# Altium schematic sheet DRAM_LPDDR4X_200P_2X32bit.SchDoc (part 2 of 2)
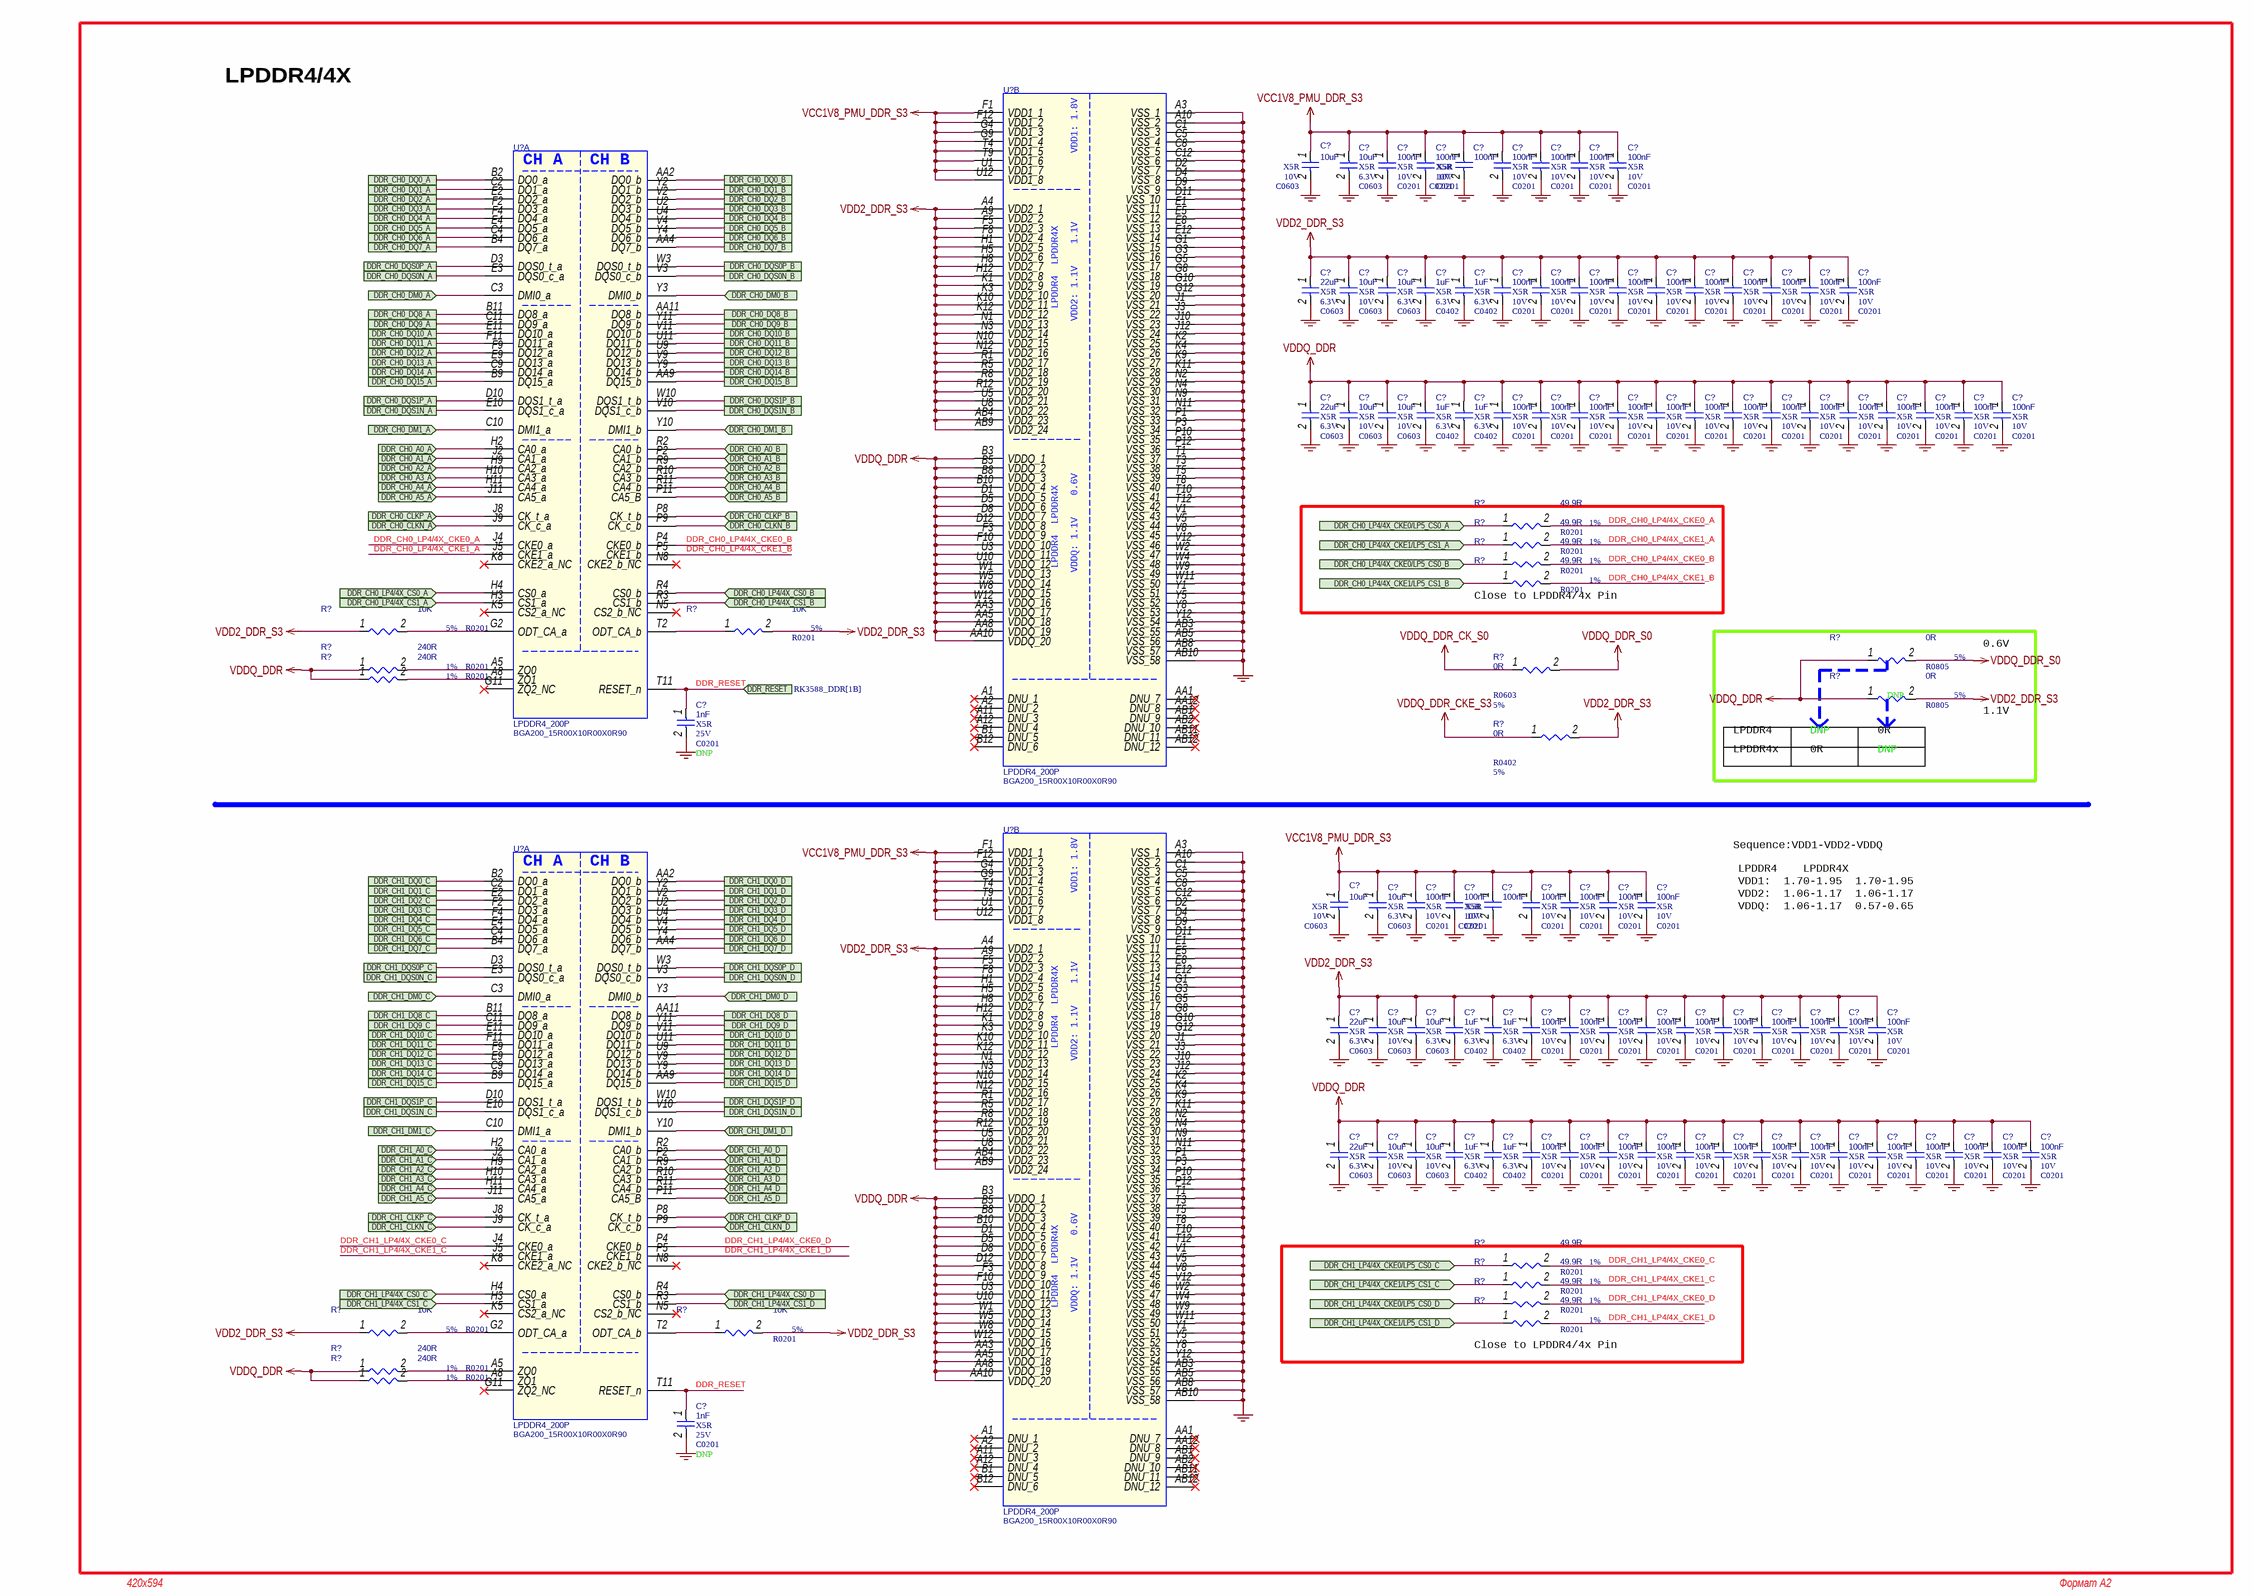
[diagram p1: DRAM_LPDDR4X_200P_2X32bit.SchDoc]

## Library data of the parts
C?#1 = CAP NP_Dup1: cap,10.00uF,+/-10%,10V,X5R,C0603; Part Reference: C3800; Manufacturer PN: C1608X5R1A106K080AC; Manufacturer: TDK; C_Voltage: 6.3V; Tolerance: 10%; Priority: A; Number: 37; PCB Footprint: C0603; Value: 10uF; Created by: JJJ; Part Type: C0603; RK PN: C1608X5R1A106K080AC
C?#2 = CAP NP_Dup1: cap,10.00uF,+/-10%,6.3V,X5R,C0603; Part Reference: C3801; Manufacturer PN: C1608X5R0J106K080AB; Manufacturer: TDK; Tolerance: 10%; Priority: A; PCB Footprint: C0603; Value: 10uF; Created by: JJJ; Part Type: C0603; RK PN: C1608X5R0J106K080AB
C?#3 = CAP NP_Dup1: cap,100.00nF,+/-10%,10V,X5R,C0201; Part Reference: C3802; Manufacturer: TDK; RK PN: C0603X5R1A104K030BC; Priority: A; Tolerance: 10%; PCB Footprint: C0201; Value: 100nF; Part Type: C0201; Manufacturer PN: C0603X5R1A104K030BC; Created by: JJJ
C?#4 = CAP NP_Dup1: cap,100.00nF,+/-10%,10V,X5R,C0201; Part Reference: C3803; Manufacturer PN: C0603X5R1A104K030BC; Manufacturer: TDK; Tolerance: 10%; Priority: A; PCB Footprint: C0201; Value: 100nF; Created by: JJJ; Part Type: C0201; RK PN: C0603X5R1A104K030BC
C?#5 = CAP NP_Dup1: cap,100.00nF,+/-10%,10V,X5R,C0201; Part Reference: C3804; Manufacturer: TDK; Number: 37; RK PN: C0603X5R1A104K030BC; Priority: A; Tolerance: 10%; C_Voltage: 6.3V; PCB Footprint: C0201; Value: 100nF; Part Type: C0201; Manufacturer PN: C0603X5R1A104K030BC; Created by: JJJ
C?#6 = CAP NP_Dup1: cap,100.00nF,+/-10%,10V,X5R,C0201; Part Reference: C3805; Manufacturer: TDK; RK PN: C0603X5R1A104K030BC; Priority: A; Tolerance: 10%; PCB Footprint: C0201; Value: 100nF; Part Type: C0201; Manufacturer PN: C0603X5R1A104K030BC; Created by: JJJ
C?#7 = CAP NP_Dup1: cap,100.00nF,+/-10%,10V,X5R,C0201; Part Reference: C3806; Manufacturer: TDK; RK PN: C0603X5R1A104K030BC; Priority: A; Tolerance: 10%; PCB Footprint: C0201; Value: 100nF; Part Type: C0201; Manufacturer PN: C0603X5R1A104K030BC; Created by: JJJ
C?#8 = CAP NP_Dup1: cap,100.00nF,+/-10%,10V,X5R,C0201; Part Reference: C3807; Manufacturer PN: C0603X5R1A104K030BC; Manufacturer: TDK; Tolerance: 10%; Priority: A; PCB Footprint: C0201; Value: 100nF; Created by: JJJ; Part Type: C0201; RK PN: C0603X5R1A104K030BC
C?#9 = CAP NP_Dup1: cap,100.00nF,+/-10%,10V,X5R,C0201; Part Reference: C3808; Manufacturer PN: C0603X5R1A104K030BC; Manufacturer: TDK; Tolerance: 10%; Priority: A; PCB Footprint: C0201; Value: 100nF; Created by: JJJ; Part Type: C0201; RK PN: C0603X5R1A104K030BC
C?#10 = CAP NP_Dup1: cap,22.00uF,+/-20%,6.3V,X5R,C0603; Part Reference: C3809; Manufacturer PN: C1608X5R0J226M080AC; Manufacturer: TDK; Tolerance: 20%; Priority: A; PCB Footprint: C0603; Value: 22uF; Created by: JJJ; C_Voltage: 6.3V; Part Type: C0603; RK PN: C1608X5R0J226M080AC
C?#11 = CAP NP_Dup1: cap,10.00uF,+/-10%,10V,X5R,C0603; Part Reference: C3810; Manufacturer PN: C1608X5R1A106K080AC; Manufacturer: TDK; Tolerance: 10%; C_Voltage: 6.3V; Priority: A; PCB Footprint: C0603; Value: 10uF; Created by: JJJ; Part Type: C0603; RK PN: C1608X5R1A106K080AC
C?#12 = CAP NP_Dup1: cap,10.00uF,+/-10%,6.3V,X5R,C0603; Part Reference: C3811; Manufacturer PN: C1608X5R0J106K080AB; Manufacturer: TDK; Tolerance: 10%; Priority: A; PCB Footprint: C0603; Value: 10uF; Created by: JJJ; Part Type: C0603; RK PN: C1608X5R0J106K080AB
C?#13 = CAP NP_Dup1: cap,1.00uF,+/-10%,6.3V,X5R,C0402; Part Reference: C3812; Manufacturer PN: C1005X5R0J105K050BB; Manufacturer: TDK; Tolerance: 10%; Priority: A; PCB Footprint: C0402; Value: 1uF; Created by: JJJ; Part Type: C0402; RK PN: C1005X5R0J105K050BB
C?#14 = CAP NP_Dup1: cap,1.00uF,+/-10%,6.3V,X5R,C0402; Part Reference: C3813; Manufacturer PN: C1005X5R0J105K050BB; Manufacturer: TDK; Tolerance: 10%; Priority: A; PCB Footprint: C0402; Value: 1uF; Created by: JJJ; Part Type: C0402; RK PN: C1005X5R0J105K050BB
C?#15 = CAP NP_Dup1: cap,100.00nF,+/-10%,10V,X5R,C0201; Part Reference: C3814; Manufacturer PN: C0603X5R1A104K030BC; Manufacturer: TDK; Tolerance: 10%; Priority: A; PCB Footprint: C0201; Value: 100nF; Created by: JJJ; Part Type: C0201; RK PN: C0603X5R1A104K030BC
C?#16 = CAP NP_Dup1: cap,100.00nF,+/-10%,10V,X5R,C0201; Part Reference: C3815; Manufacturer PN: C0603X5R1A104K030BC; Manufacturer: TDK; Tolerance: 10%; Priority: A; PCB Footprint: C0201; Value: 100nF; Created by: JJJ; Part Type: C0201; RK PN: C0603X5R1A104K030BC
C?#17 = CAP NP_Dup1: cap,100.00nF,+/-10%,10V,X5R,C0201; Part Reference: C3816; Manufacturer: TDK; RK PN: C0603X5R1A104K030BC; Priority: A; Tolerance: 10%; PCB Footprint: C0201; Value: 100nF; Part Type: C0201; Manufacturer PN: C0603X5R1A104K030BC; Created by: JJJ
C?#18 = CAP NP_Dup1: cap,100.00nF,+/-10%,10V,X5R,C0201; Part Reference: C3817; Manufacturer PN: C0603X5R1A104K030BC; Manufacturer: TDK; Tolerance: 10%; Priority: A; PCB Footprint: C0201; Value: 100nF; Created by: JJJ; Part Type: C0201; RK PN: C0603X5R1A104K030BC
C?#19 = CAP NP_Dup1: cap,100.00nF,+/-10%,10V,X5R,C0201; Part Reference: C3818; Manufacturer PN: C0603X5R1A104K030BC; Manufacturer: TDK; Tolerance: 10%; Priority: A; PCB Footprint: C0201; Value: 100nF; Created by: JJJ; Part Type: C0201; RK PN: C0603X5R1A104K030BC
C?#20 = CAP NP_Dup1: cap,100.00nF,+/-10%,10V,X5R,C0201; Part Reference: C3819; Manufacturer: TDK; RK PN: C0603X5R1A104K030BC; Priority: A; Tolerance: 10%; PCB Footprint: C0201; Value: 100nF; Part Type: C0201; Manufacturer PN: C0603X5R1A104K030BC; Created by: JJJ
C?#21 = CAP NP_Dup1: cap,100.00nF,+/-10%,10V,X5R,C0201; Part Reference: C3820; Manufacturer: TDK; RK PN: C0603X5R1A104K030BC; Priority: A; Tolerance: 10%; PCB Footprint: C0201; Value: 100nF; Part Type: C0201; Manufacturer PN: C0603X5R1A104K030BC; Created by: JJJ
C?#22 = CAP NP_Dup1: cap,100.00nF,+/-10%,10V,X5R,C0201; Part Reference: C3821; Manufacturer PN: C0603X5R1A104K030BC; Manufacturer: TDK; Tolerance: 10%; Priority: A; PCB Footprint: C0201; Value: 100nF; Created by: JJJ; Part Type: C0201; RK PN: C0603X5R1A104K030BC
C?#23 = CAP NP_Dup1: cap,100.00nF,+/-10%,10V,X5R,C0201; Part Reference: C3822; Manufacturer: TDK; RK PN: C0603X5R1A104K030BC; Priority: A; Tolerance: 10%; PCB Footprint: C0201; Value: 100nF; Part Type: C0201; Manufacturer PN: C0603X5R1A104K030BC; Created by: JJJ
C?#24 = CAP NP_Dup1: cap,100.00nF,+/-10%,10V,X5R,C0201; Part Reference: C3823; Manufacturer PN: C0603X5R1A104K030BC; Manufacturer: TDK; Tolerance: 10%; Priority: A; PCB Footprint: C0201; Value: 100nF; Created by: JJJ; Part Type: C0201; RK PN: C0603X5R1A104K030BC
C?#25 = CAP NP_Dup1: cap,22.00uF,+/-20%,6.3V,X5R,C0603; Part Reference: C3824; Manufacturer: TDK; RK PN: C1608X5R0J226M080AC; Priority: A; Tolerance: 20%; PCB Footprint: C0603; Value: 22uF; Part Type: C0603; C_Voltage: 6.3V; Manufacturer PN: C1608X5R0J226M080AC; Created by: JJJ
C?#26 = CAP NP_Dup1: cap,10.00uF,+/-10%,10V,X5R,C0603; Part Reference: C3825; Manufacturer PN: C1608X5R1A106K080AC; Manufacturer: TDK; Tolerance: 10%; C_Voltage: 6.3V; Priority: A; PCB Footprint: C0603; Value: 10uF; Created by: JJJ; Part Type: C0603; RK PN: C1608X5R1A106K080AC
C?#27 = CAP NP_Dup1: cap,10.00uF,+/-10%,10V,X5R,C0603; Part Reference: C3826; Manufacturer: TDK; RK PN: C1608X5R1A106K080AC; Priority: A; C_Voltage: 6.3V; Tolerance: 10%; PCB Footprint: C0603; Value: 10uF; Part Type: C0603; Manufacturer PN: C1608X5R1A106K080AC; Created by: JJJ
C?#28 = CAP NP_Dup1: cap,1.00uF,+/-10%,6.3V,X5R,C0402; Part Reference: C3827; Manufacturer: TDK; RK PN: C1005X5R0J105K050BB; Priority: A; Tolerance: 10%; PCB Footprint: C0402; Value: 1uF; Part Type: C0402; Manufacturer PN: C1005X5R0J105K050BB; Created by: JJJ
C?#29 = CAP NP_Dup1: cap,1.00uF,+/-10%,6.3V,X5R,C0402; Part Reference: C3828; Manufacturer: TDK; RK PN: C1005X5R0J105K050BB; Priority: A; Tolerance: 10%; PCB Footprint: C0402; Value: 1uF; Part Type: C0402; Manufacturer PN: C1005X5R0J105K050BB; Created by: JJJ
C?#30 = CAP NP_Dup1: cap,100.00nF,+/-10%,10V,X5R,C0201; Part Reference: C3829; Manufacturer: TDK; RK PN: C0603X5R1A104K030BC; Priority: A; Tolerance: 10%; PCB Footprint: C0201; Value: 100nF; Part Type: C0201; Manufacturer PN: C0603X5R1A104K030BC; Created by: JJJ
C?#31 = CAP NP_Dup1: cap,100.00nF,+/-10%,10V,X5R,C0201; Part Reference: C3830; Manufacturer: TDK; RK PN: C0603X5R1A104K030BC; Priority: A; Tolerance: 10%; PCB Footprint: C0201; Value: 100nF; Part Type: C0201; Manufacturer PN: C0603X5R1A104K030BC; Created by: JJJ
C?#32 = CAP NP_Dup1: cap,100.00nF,+/-10%,10V,X5R,C0201; Part Reference: C3831; Manufacturer: TDK; RK PN: C0603X5R1A104K030BC; Priority: A; Tolerance: 10%; PCB Footprint: C0201; Value: 100nF; Part Type: C0201; Manufacturer PN: C0603X5R1A104K030BC; Created by: JJJ
C?#33 = CAP NP_Dup1: cap,100.00nF,+/-10%,10V,X5R,C0201; Part Reference: C3832; Manufacturer PN: C0603X5R1A104K030BC; Manufacturer: TDK; Tolerance: 10%; Priority: A; PCB Footprint: C0201; Value: 100nF; Created by: JJJ; Part Type: C0201; RK PN: C0603X5R1A104K030BC
C?#34 = CAP NP_Dup1: cap,100.00nF,+/-10%,10V,X5R,C0201; Part Reference: C3833; Manufacturer PN: C0603X5R1A104K030BC; Manufacturer: TDK; Tolerance: 10%; Priority: A; PCB Footprint: C0201; Value: 100nF; Created by: JJJ; Part Type: C0201; RK PN: C0603X5R1A104K030BC
C?#35 = CAP NP_Dup1: cap,100.00nF,+/-10%,10V,X5R,C0201; Part Reference: C3834; Manufacturer PN: C0603X5R1A104K030BC; Manufacturer: TDK; Tolerance: 10%; Priority: A; PCB Footprint: C0201; Value: 100nF; Created by: JJJ; Part Type: C0201; RK PN: C0603X5R1A104K030BC
C?#36 = CAP NP_Dup1: cap,100.00nF,+/-10%,10V,X5R,C0201; Part Reference: C3835; Manufacturer: TDK; RK PN: C0603X5R1A104K030BC; Priority: A; Tolerance: 10%; PCB Footprint: C0201; Value: 100nF; Part Type: C0201; Manufacturer PN: C0603X5R1A104K030BC; Created by: JJJ
C?#37 = CAP NP_Dup1: cap,100.00nF,+/-10%,10V,X5R,C0201; Part Reference: C3836; Manufacturer PN: C0603X5R1A104K030BC; Manufacturer: TDK; Tolerance: 10%; Priority: A; PCB Footprint: C0201; Value: 100nF; Created by: JJJ; Part Type: C0201; RK PN: C0603X5R1A104K030BC
C?#38 = CAP NP_Dup1: cap,100.00nF,+/-10%,10V,X5R,C0201; Part Reference: C3837; Manufacturer PN: C0603X5R1A104K030BC; Manufacturer: TDK; Tolerance: 10%; Priority: A; PCB Footprint: C0201; Value: 100nF; Created by: JJJ; Part Type: C0201; RK PN: C0603X5R1A104K030BC
C?#39 = CAP NP_Dup1: cap,100.00nF,+/-10%,10V,X5R,C0201; Part Reference: C3838; Manufacturer: TDK; RK PN: C0603X5R1A104K030BC; Priority: A; Tolerance: 10%; PCB Footprint: C0201; Value: 100nF; Part Type: C0201; Manufacturer PN: C0603X5R1A104K030BC; Created by: JJJ
C?#40 = CAP NP_Dup1: cap,100.00nF,+/-10%,10V,X5R,C0201; Part Reference: C3839; Manufacturer PN: C0603X5R1A104K030BC; Manufacturer: TDK; Tolerance: 10%; Priority: A; PCB Footprint: C0201; Value: 100nF; Created by: JJJ; Part Type: C0201; RK PN: C0603X5R1A104K030BC
C?#41 = CAP NP_Dup1: cap,100.00nF,+/-10%,10V,X5R,C0201; Part Reference: C3840; Manufacturer: TDK; RK PN: C0603X5R1A104K030BC; Priority: A; Tolerance: 10%; PCB Footprint: C0201; Value: 100nF; Part Type: C0201; Manufacturer PN: C0603X5R1A104K030BC; Created by: JJJ
C?#42 = CAP NP_Dup1: cap,100.00nF,+/-10%,10V,X5R,C0201; Part Reference: C3841; Manufacturer: TDK; RK PN: C0603X5R1A104K030BC; Priority: A; Tolerance: 10%; PCB Footprint: C0201; Value: 100nF; Part Type: C0201; Manufacturer PN: C0603X5R1A104K030BC; Created by: JJJ
C?#43 = CAP NP_Dup1: cap,100.00nF,+/-10%,10V,X5R,C0201; Part Reference: C3842; Manufacturer: TDK; RK PN: C0603X5R1A104K030BC; Priority: A; Tolerance: 10%; PCB Footprint: C0201; Value: 100nF; Part Type: C0201; Manufacturer PN: C0603X5R1A104K030BC; Created by: JJJ
C?#44 = CAP NP_Dup1: cap,1.00nF,+/-10%,25V,X5R,C0201; Part Reference: C3844; Manufacturer: TDK; RK PN: C0603X5R1E102K030BA; Priority: A; Tolerance: 10%; PCB Footprint: C0201; Value: 1nF; Part Type: C0201; Manufacturer PN: C0603X5R1E102K030BA; Created by: JJJ
C?#45 = CAP NP_Dup1: cap,10.00uF,+/-10%,10V,X5R,C0603; Part Reference: C3845; Manufacturer PN: C1608X5R1A106K080AC; Manufacturer: TDK; C_Voltage: 6.3V; Tolerance: 10%; Priority: A; Number: 37; PCB Footprint: C0603; Value: 10uF; Created by: JJJ; Part Type: C0603; RK PN: C1608X5R1A106K080AC
C?#46 = CAP NP_Dup1: cap,10.00uF,+/-10%,6.3V,X5R,C0603; Part Reference: C3846; Manufacturer PN: C1608X5R0J106K080AB; Manufacturer: TDK; Tolerance: 10%; Priority: A; PCB Footprint: C0603; Value: 10uF; Created by: JJJ; Part Type: C0603; RK PN: C1608X5R0J106K080AB
C?#47 = CAP NP_Dup1: cap,100.00nF,+/-10%,10V,X5R,C0201; Part Reference: C3847; Manufacturer: TDK; RK PN: C0603X5R1A104K030BC; Priority: A; Tolerance: 10%; PCB Footprint: C0201; Value: 100nF; Part Type: C0201; Manufacturer PN: C0603X5R1A104K030BC; Created by: JJJ
C?#48 = CAP NP_Dup1: cap,100.00nF,+/-10%,10V,X5R,C0201; Part Reference: C3848; Manufacturer PN: C0603X5R1A104K030BC; Manufacturer: TDK; Tolerance: 10%; Priority: A; PCB Footprint: C0201; Value: 100nF; Created by: JJJ; Part Type: C0201; RK PN: C0603X5R1A104K030BC
C?#49 = CAP NP_Dup1: cap,100.00nF,+/-10%,10V,X5R,C0201; Part Reference: C3849; Manufacturer: TDK; Number: 37; RK PN: C0603X5R1A104K030BC; Priority: A; Tolerance: 10%; C_Voltage: 6.3V; PCB Footprint: C0201; Value: 100nF; Part Type: C0201; Manufacturer PN: C0603X5R1A104K030BC; Created by: JJJ
C?#50 = CAP NP_Dup1: cap,100.00nF,+/-10%,10V,X5R,C0201; Part Reference: C3850; Manufacturer: TDK; RK PN: C0603X5R1A104K030BC; Priority: A; Tolerance: 10%; PCB Footprint: C0201; Value: 100nF; Part Type: C0201; Manufacturer PN: C0603X5R1A104K030BC; Created by: JJJ
C?#51 = CAP NP_Dup1: cap,100.00nF,+/-10%,10V,X5R,C0201; Part Reference: C3851; Manufacturer: TDK; RK PN: C0603X5R1A104K030BC; Priority: A; Tolerance: 10%; PCB Footprint: C0201; Value: 100nF; Part Type: C0201; Manufacturer PN: C0603X5R1A104K030BC; Created by: JJJ
C?#52 = CAP NP_Dup1: cap,100.00nF,+/-10%,10V,X5R,C0201; Part Reference: C3852; Manufacturer PN: C0603X5R1A104K030BC; Manufacturer: TDK; Tolerance: 10%; Priority: A; PCB Footprint: C0201; Value: 100nF; Created by: JJJ; Part Type: C0201; RK PN: C0603X5R1A104K030BC
C?#53 = CAP NP_Dup1: cap,100.00nF,+/-10%,10V,X5R,C0201; Part Reference: C3853; Manufacturer PN: C0603X5R1A104K030BC; Manufacturer: TDK; Tolerance: 10%; Priority: A; PCB Footprint: C0201; Value: 100nF; Created by: JJJ; Part Type: C0201; RK PN: C0603X5R1A104K030BC
C?#54 = CAP NP_Dup1: cap,22.00uF,+/-20%,6.3V,X5R,C0603; Part Reference: C3854; Manufacturer PN: C1608X5R0J226M080AC; Manufacturer: TDK; Tolerance: 20%; Priority: A; PCB Footprint: C0603; Value: 22uF; Created by: JJJ; C_Voltage: 6.3V; Part Type: C0603; RK PN: C1608X5R0J226M080AC
C?#55 = CAP NP_Dup1: cap,10.00uF,+/-10%,10V,X5R,C0603; Part Reference: C3855; Manufacturer PN: C1608X5R1A106K080AC; Manufacturer: TDK; Tolerance: 10%; C_Voltage: 6.3V; Priority: A; PCB Footprint: C0603; Value: 10uF; Created by: JJJ; Part Type: C0603; RK PN: C1608X5R1A106K080AC
C?#56 = CAP NP_Dup1: cap,10.00uF,+/-10%,6.3V,X5R,C0603; Part Reference: C3856; Manufacturer PN: C1608X5R0J106K080AB; Manufacturer: TDK; Tolerance: 10%; Priority: A; PCB Footprint: C0603; Value: 10uF; Created by: JJJ; Part Type: C0603; RK PN: C1608X5R0J106K080AB
C?#57 = CAP NP_Dup1: cap,1.00uF,+/-10%,6.3V,X5R,C0402; Part Reference: C3857; Manufacturer PN: C1005X5R0J105K050BB; Manufacturer: TDK; Tolerance: 10%; Priority: A; PCB Footprint: C0402; Value: 1uF; Created by: JJJ; Part Type: C0402; RK PN: C1005X5R0J105K050BB
C?#58 = CAP NP_Dup1: cap,1.00uF,+/-10%,6.3V,X5R,C0402; Part Reference: C3858; Manufacturer PN: C1005X5R0J105K050BB; Manufacturer: TDK; Tolerance: 10%; Priority: A; PCB Footprint: C0402; Value: 1uF; Created by: JJJ; Part Type: C0402; RK PN: C1005X5R0J105K050BB
C?#59 = CAP NP_Dup1: cap,100.00nF,+/-10%,10V,X5R,C0201; Part Reference: C3859; Manufacturer PN: C0603X5R1A104K030BC; Manufacturer: TDK; Tolerance: 10%; Priority: A; PCB Footprint: C0201; Value: 100nF; Created by: JJJ; Part Type: C0201; RK PN: C0603X5R1A104K030BC
C?#60 = CAP NP_Dup1: cap,100.00nF,+/-10%,10V,X5R,C0201; Part Reference: C3860; Manufacturer PN: C0603X5R1A104K030BC; Manufacturer: TDK; Tolerance: 10%; Priority: A; PCB Footprint: C0201; Value: 100nF; Created by: JJJ; Part Type: C0201; RK PN: C0603X5R1A104K030BC
C?#61 = CAP NP_Dup1: cap,100.00nF,+/-10%,10V,X5R,C0201; Part Reference: C3861; Manufacturer: TDK; RK PN: C0603X5R1A104K030BC; Priority: A; Tolerance: 10%; PCB Footprint: C0201; Value: 100nF; Part Type: C0201; Manufacturer PN: C0603X5R1A104K030BC; Created by: JJJ
C?#62 = CAP NP_Dup1: cap,100.00nF,+/-10%,10V,X5R,C0201; Part Reference: C3862; Manufacturer PN: C0603X5R1A104K030BC; Manufacturer: TDK; Tolerance: 10%; Priority: A; PCB Footprint: C0201; Value: 100nF; Created by: JJJ; Part Type: C0201; RK PN: C0603X5R1A104K030BC
C?#63 = CAP NP_Dup1: cap,100.00nF,+/-10%,10V,X5R,C0201; Part Reference: C3863; Manufacturer PN: C0603X5R1A104K030BC; Manufacturer: TDK; Tolerance: 10%; Priority: A; PCB Footprint: C0201; Value: 100nF; Created by: JJJ; Part Type: C0201; RK PN: C0603X5R1A104K030BC
C?#64 = CAP NP_Dup1: cap,100.00nF,+/-10%,10V,X5R,C0201; Part Reference: C3864; Manufacturer: TDK; RK PN: C0603X5R1A104K030BC; Priority: A; Tolerance: 10%; PCB Footprint: C0201; Value: 100nF; Part Type: C0201; Manufacturer PN: C0603X5R1A104K030BC; Created by: JJJ
C?#65 = CAP NP_Dup1: cap,100.00nF,+/-10%,10V,X5R,C0201; Part Reference: C3865; Manufacturer: TDK; RK PN: C0603X5R1A104K030BC; Priority: A; Tolerance: 10%; PCB Footprint: C0201; Value: 100nF; Part Type: C0201; Manufacturer PN: C0603X5R1A104K030BC; Created by: JJJ
C?#66 = CAP NP_Dup1: cap,100.00nF,+/-10%,10V,X5R,C0201; Part Reference: C3866; Manufacturer PN: C0603X5R1A104K030BC; Manufacturer: TDK; Tolerance: 10%; Priority: A; PCB Footprint: C0201; Value: 100nF; Created by: JJJ; Part Type: C0201; RK PN: C0603X5R1A104K030BC
C?#67 = CAP NP_Dup1: cap,100.00nF,+/-10%,10V,X5R,C0201; Part Reference: C3867; Manufacturer: TDK; RK PN: C0603X5R1A104K030BC; Priority: A; Tolerance: 10%; PCB Footprint: C0201; Value: 100nF; Part Type: C0201; Manufacturer PN: C0603X5R1A104K030BC; Created by: JJJ
C?#68 = CAP NP_Dup1: cap,100.00nF,+/-10%,10V,X5R,C0201; Part Reference: C3868; Manufacturer PN: C0603X5R1A104K030BC; Manufacturer: TDK; Tolerance: 10%; Priority: A; PCB Footprint: C0201; Value: 100nF; Created by: JJJ; Part Type: C0201; RK PN: C0603X5R1A104K030BC
C?#69 = CAP NP_Dup1: cap,22.00uF,+/-20%,6.3V,X5R,C0603; Part Reference: C3869; Manufacturer: TDK; RK PN: C1608X5R0J226M080AC; Priority: A; Tolerance: 20%; PCB Footprint: C0603; Value: 22uF; Part Type: C0603; C_Voltage: 6.3V; Manufacturer PN: C1608X5R0J226M080AC; Created by: JJJ
C?#70 = CAP NP_Dup1: cap,10.00uF,+/-10%,10V,X5R,C0603; Part Reference: C3870; Manufacturer PN: C1608X5R1A106K080AC; Manufacturer: TDK; Tolerance: 10%; C_Voltage: 6.3V; Priority: A; PCB Footprint: C0603; Value: 10uF; Created by: JJJ; Part Type: C0603; RK PN: C1608X5R1A106K080AC
C?#71 = CAP NP_Dup1: cap,10.00uF,+/-10%,10V,X5R,C0603; Part Reference: C3871; Manufacturer: TDK; RK PN: C1608X5R1A106K080AC; Priority: A; C_Voltage: 6.3V; Tolerance: 10%; PCB Footprint: C0603; Value: 10uF; Part Type: C0603; Manufacturer PN: C1608X5R1A106K080AC; Created by: JJJ
C?#72 = CAP NP_Dup1: cap,1.00uF,+/-10%,6.3V,X5R,C0402; Part Reference: C3872; Manufacturer: TDK; RK PN: C1005X5R0J105K050BB; Priority: A; Tolerance: 10%; PCB Footprint: C0402; Value: 1uF; Part Type: C0402; Manufacturer PN: C1005X5R0J105K050BB; Created by: JJJ
C?#73 = CAP NP_Dup1: cap,1.00uF,+/-10%,6.3V,X5R,C0402; Part Reference: C3873; Manufacturer: TDK; RK PN: C1005X5R0J105K050BB; Priority: A; Tolerance: 10%; PCB Footprint: C0402; Value: 1uF; Part Type: C0402; Manufacturer PN: C1005X5R0J105K050BB; Created by: JJJ
C?#74 = CAP NP_Dup1: cap,100.00nF,+/-10%,10V,X5R,C0201; Part Reference: C3874; Manufacturer: TDK; RK PN: C0603X5R1A104K030BC; Priority: A; Tolerance: 10%; PCB Footprint: C0201; Value: 100nF; Part Type: C0201; Manufacturer PN: C0603X5R1A104K030BC; Created by: JJJ
C?#75 = CAP NP_Dup1: cap,100.00nF,+/-10%,10V,X5R,C0201; Part Reference: C3875; Manufacturer: TDK; RK PN: C0603X5R1A104K030BC; Priority: A; Tolerance: 10%; PCB Footprint: C0201; Value: 100nF; Part Type: C0201; Manufacturer PN: C0603X5R1A104K030BC; Created by: JJJ
C?#76 = CAP NP_Dup1: cap,100.00nF,+/-10%,10V,X5R,C0201; Part Reference: C3876; Manufacturer: TDK; RK PN: C0603X5R1A104K030BC; Priority: A; Tolerance: 10%; PCB Footprint: C0201; Value: 100nF; Part Type: C0201; Manufacturer PN: C0603X5R1A104K030BC; Created by: JJJ
C?#77 = CAP NP_Dup1: cap,100.00nF,+/-10%,10V,X5R,C0201; Part Reference: C3877; Manufacturer PN: C0603X5R1A104K030BC; Manufacturer: TDK; Tolerance: 10%; Priority: A; PCB Footprint: C0201; Value: 100nF; Created by: JJJ; Part Type: C0201; RK PN: C0603X5R1A104K030BC
C?#78 = CAP NP_Dup1: cap,100.00nF,+/-10%,10V,X5R,C0201; Part Reference: C3878; Manufacturer PN: C0603X5R1A104K030BC; Manufacturer: TDK; Tolerance: 10%; Priority: A; PCB Footprint: C0201; Value: 100nF; Created by: JJJ; Part Type: C0201; RK PN: C0603X5R1A104K030BC
C?#79 = CAP NP_Dup1: cap,100.00nF,+/-10%,10V,X5R,C0201; Part Reference: C3879; Manufacturer PN: C0603X5R1A104K030BC; Manufacturer: TDK; Tolerance: 10%; Priority: A; PCB Footprint: C0201; Value: 100nF; Created by: JJJ; Part Type: C0201; RK PN: C0603X5R1A104K030BC
C?#80 = CAP NP_Dup1: cap,100.00nF,+/-10%,10V,X5R,C0201; Part Reference: C3880; Manufacturer: TDK; RK PN: C0603X5R1A104K030BC; Priority: A; Tolerance: 10%; PCB Footprint: C0201; Value: 100nF; Part Type: C0201; Manufacturer PN: C0603X5R1A104K030BC; Created by: JJJ
C?#81 = CAP NP_Dup1: cap,100.00nF,+/-10%,10V,X5R,C0201; Part Reference: C3881; Manufacturer PN: C0603X5R1A104K030BC; Manufacturer: TDK; Tolerance: 10%; Priority: A; PCB Footprint: C0201; Value: 100nF; Created by: JJJ; Part Type: C0201; RK PN: C0603X5R1A104K030BC
C?#82 = CAP NP_Dup1: cap,100.00nF,+/-10%,10V,X5R,C0201; Part Reference: C3882; Manufacturer PN: C0603X5R1A104K030BC; Manufacturer: TDK; Tolerance: 10%; Priority: A; PCB Footprint: C0201; Value: 100nF; Created by: JJJ; Part Type: C0201; RK PN: C0603X5R1A104K030BC
C?#83 = CAP NP_Dup1: cap,100.00nF,+/-10%,10V,X5R,C0201; Part Reference: C3883; Manufacturer: TDK; RK PN: C0603X5R1A104K030BC; Priority: A; Tolerance: 10%; PCB Footprint: C0201; Value: 100nF; Part Type: C0201; Manufacturer PN: C0603X5R1A104K030BC; Created by: JJJ
C?#84 = CAP NP_Dup1: cap,100.00nF,+/-10%,10V,X5R,C0201; Part Reference: C3884; Manufacturer PN: C0603X5R1A104K030BC; Manufacturer: TDK; Tolerance: 10%; Priority: A; PCB Footprint: C0201; Value: 100nF; Created by: JJJ; Part Type: C0201; RK PN: C0603X5R1A104K030BC
C?#85 = CAP NP_Dup1: cap,100.00nF,+/-10%,10V,X5R,C0201; Part Reference: C3885; Manufacturer: TDK; RK PN: C0603X5R1A104K030BC; Priority: A; Tolerance: 10%; PCB Footprint: C0201; Value: 100nF; Part Type: C0201; Manufacturer PN: C0603X5R1A104K030BC; Created by: JJJ
C?#86 = CAP NP_Dup1: cap,100.00nF,+/-10%,10V,X5R,C0201; Part Reference: C3886; Manufacturer: TDK; RK PN: C0603X5R1A104K030BC; Priority: A; Tolerance: 10%; PCB Footprint: C0201; Value: 100nF; Part Type: C0201; Manufacturer PN: C0603X5R1A104K030BC; Created by: JJJ
C?#87 = CAP NP_Dup1: cap,100.00nF,+/-10%,10V,X5R,C0201; Part Reference: C3887; Manufacturer: TDK; RK PN: C0603X5R1A104K030BC; Priority: A; Tolerance: 10%; PCB Footprint: C0201; Value: 100nF; Part Type: C0201; Manufacturer PN: C0603X5R1A104K030BC; Created by: JJJ
C?#88 = CAP NP_Dup1: cap,1.00nF,+/-10%,25V,X5R,C0201; Part Reference: C3888; Manufacturer: TDK; RK PN: C0603X5R1E102K030BA; Priority: A; Tolerance: 10%; PCB Footprint: C0201; Value: 1nF; Part Type: C0201; Manufacturer PN: C0603X5R1E102K030BA; Created by: JJJ
R?#1 = RESISTOR_Dup2: НЁУГєсД¤µзЧи,49R9,+/-1%,R0201,1/20W.; Part Reference: R3801; Manufacturer: YAGEO; RK PN: RC0201FR-0749R9L; Priority: A; Wattage: 1/20W; Value: 49.9R; Part Type: НЁУГєсД¤µзЧи; Manufacturer PN: RC0201FR-0749R9L; Created by: YTL
R?#2 = RESISTOR_Dup2: НЁУГєсД¤µзЧи,49R9,+/-1%,R0201,1/20W.; Part Reference: R3802; Manufacturer: YAGEO; Wattage: 1/20W; RK PN: RC0201FR-0749R9L; Priority: A; Value: 49.9R; Part Type: НЁУГєсД¤µзЧи; Manufacturer PN: RC0201FR-0749R9L; Created by: YTL
R?#3 = RESISTOR_Dup2: НЁУГєсД¤µзЧи,49R9,+/-1%,R0201,1/20W.; Part Reference: R3804; Manufacturer PN: RC0201FR-0749R9L; Manufacturer: YAGEO; Priority: A; Wattage: 1/20W; Value: 49.9R; Created by: YTL; Part Type: НЁУГєсД¤µзЧи; RK PN: RC0201FR-0749R9L
R?#4 = RESISTOR_Dup2: НЁУГєсД¤µзЧи,49R9,+/-1%,R0201,1/20W.; Part Reference: R3805; Manufacturer: YAGEO; Manufacturer PN: RC0201FR-0749R9L; Wattage: 1/20W; Priority: A; Value: 49.9R; Created by: YTL; Part Type: НЁУГєсД¤µзЧи; RK PN: RC0201FR-0749R9L
R?#5 = RESISTOR_Dup2: НЁУГєсД¤µзЧи,10K,+/-5%,R0201,1/20W.; Part Reference: R3806; Manufacturer: YAGEO; RK PN: RC0201JR-0710KL; Priority: A; Wattage: 1/20W; Value: 10K; Part Type: НЁУГєсД¤µзЧи; Manufacturer PN: RC0201JR-0710KL; Created by: YTL
R?#6 = RESISTOR_Dup2: НЁУГєсД¤µзЧи,10K,+/-5%,R0201,1/20W.; Part Reference: R3807; Manufacturer: YAGEO; RK PN: RC0201JR-0710KL; Priority: A; Wattage: 1/20W; Value: 10K; Part Type: НЁУГєсД¤µзЧи; Manufacturer PN: RC0201JR-0710KL; Created by: YTL
R?#7 = RESISTOR_Dup2: НЁУГєсД¤µзЧи,0R,+/-5%,R0805,1/8W.; Part Reference: R3808; Manufacturer PN: RC0805JR-070RL; Manufacturer: YAGEO; Wattage: 1/8W; Priority: A; Value: 0R; Created by: YTL; Part Type: НЁУГєсД¤µзЧи; RK PN: RC0805JR-070RL
R?#8 = RESISTOR_Dup2: НЁУГєсД¤µзЧи,240R,+/-1%,R0201,1/20W.; Part Reference: R3809; Manufacturer PN: RC0201FR-07240RL; Manufacturer: YAGEO; Wattage: 1/20W; Priority: A; Value: 240R; Created by: YTL; Part Type: НЁУГєсД¤µзЧи; RK PN: RC0201FR-07240RL
R?#9 = RESISTOR_Dup2: НЁУГєсД¤µзЧи,0R,+/-5%,R0603,1/10W.; Part Reference: R1204; Manufacturer: YAGEO; RK PN: RC0603JR-070RL; Priority: A; Wattage: 1/10W; Value: 0R; Part Type: НЁУГєсД¤µзЧи; Manufacturer PN: RC0603JR-070RL; Created by: YTL
R?#10 = RESISTOR_Dup2: НЁУГєсД¤µзЧи,240R,+/-1%,R0201,1/20W.; Part Reference: R3810; Manufacturer: YAGEO; RK PN: RC0201FR-07240RL; Priority: A; Wattage: 1/20W; Value: 240R; Part Type: НЁУГєсД¤µзЧи; Manufacturer PN: RC0201FR-07240RL; Created by: YTL
R?#11 = RESISTOR_Dup2: НЁУГєсД¤µзЧи,0R,+/-5%,R0805,1/8W.; Part Reference: R3811; Manufacturer: YAGEO; RK PN: RC0805JR-070RL; Priority: A; Wattage: 1/8W; Value: 0R; Part Type: НЁУГєсД¤µзЧи; Manufacturer PN: RC0805JR-070RL; Created by: YTL
R?#12 = RESISTOR_Dup2: НЁУГєсД¤µзЧи,0R,+/-5%,R0402,1/16W.; Part Reference: R1205; Manufacturer PN: RC0402JR-070RL; Manufacturer: YAGEO; Wattage: 1/16W; Priority: A; PCB Footprint: R0402; Value: 0R; Created by: YTL; Part Type: НЁУГєсД¤µзЧи; RK PN: RC0402JR-070RL
R?#13 = RESISTOR_Dup2: НЁУГєсД¤µзЧи,49R9,+/-1%,R0201,1/20W.; Part Reference: R3812; Manufacturer PN: RC0201FR-0749R9L; Manufacturer: YAGEO; Priority: A; Wattage: 1/20W; Value: 49.9R; Created by: YTL; Part Type: НЁУГєсД¤µзЧи; RK PN: RC0201FR-0749R9L
R?#14 = RESISTOR_Dup2: НЁУГєсД¤µзЧи,49R9,+/-1%,R0201,1/20W.; Part Reference: R3813; Manufacturer: YAGEO; RK PN: RC0201FR-0749R9L; Priority: A; Wattage: 1/20W; Value: 49.9R; Part Type: НЁУГєсД¤µзЧи; Manufacturer PN: RC0201FR-0749R9L; Created by: YTL
R?#15 = RESISTOR_Dup2: НЁУГєсД¤µзЧи,49R9,+/-1%,R0201,1/20W.; Part Reference: R3814; Manufacturer: YAGEO; RK PN: RC0201FR-0749R9L; Priority: A; Wattage: 1/20W; Value: 49.9R; Part Type: НЁУГєсД¤µзЧи; Manufacturer PN: RC0201FR-0749R9L; Created by: YTL
R?#16 = RESISTOR_Dup2: НЁУГєсД¤µзЧи,49R9,+/-1%,R0201,1/20W.; Part Reference: R3815; Manufacturer PN: RC0201FR-0749R9L; Manufacturer: YAGEO; Priority: A; Wattage: 1/20W; Value: 49.9R; Created by: YTL; Part Type: НЁУГєсД¤µзЧи; RK PN: RC0201FR-0749R9L
R?#17 = RESISTOR_Dup2: НЁУГєсД¤µзЧи,10K,+/-5%,R0201,1/20W.; Part Reference: R3816; Manufacturer PN: RC0201JR-0710KL; Manufacturer: YAGEO; Wattage: 1/20W; Priority: A; Value: 10K; Created by: YTL; Part Type: НЁУГєсД¤µзЧи; RK PN: RC0201JR-0710KL
R?#18 = RESISTOR_Dup2: НЁУГєсД¤µзЧи,10K,+/-5%,R0201,1/20W.; Part Reference: R3817; Manufacturer PN: RC0201JR-0710KL; Manufacturer: YAGEO; Wattage: 1/20W; Priority: A; Value: 10K; Created by: YTL; Part Type: НЁУГєсД¤µзЧи; RK PN: RC0201JR-0710KL
R?#19 = RESISTOR_Dup2: НЁУГєсД¤µзЧи,240R,+/-1%,R0201,1/20W.; Part Reference: R3818; Manufacturer PN: RC0201FR-07240RL; Manufacturer: YAGEO; Wattage: 1/20W; Priority: A; Value: 240R; Created by: YTL; Part Type: НЁУГєсД¤µзЧи; RK PN: RC0201FR-07240RL
R?#20 = RESISTOR_Dup2: НЁУГєсД¤µзЧи,240R,+/-1%,R0201,1/20W.; Part Reference: R3819; Manufacturer PN: RC0201FR-07240RL; Manufacturer: YAGEO; Wattage: 1/20W; Priority: A; Value: 240R; Created by: YTL; Part Type: НЁУГєсД¤µзЧи; RK PN: RC0201FR-07240RL
U?#1 U?#2 = LPDDR4_200P: Part Reference: U3800; PCB Footprint: BGA200_15R00X10R00X0R90; Value: LPDDR4_200P
U?#3 U?#4 = LPDDR4_200P: Part Reference: U3801; PCB Footprint: BGA200_15R00X10R00X0R90; Value: LPDDR4_200P